# Altium project NetV510.PrjPCB
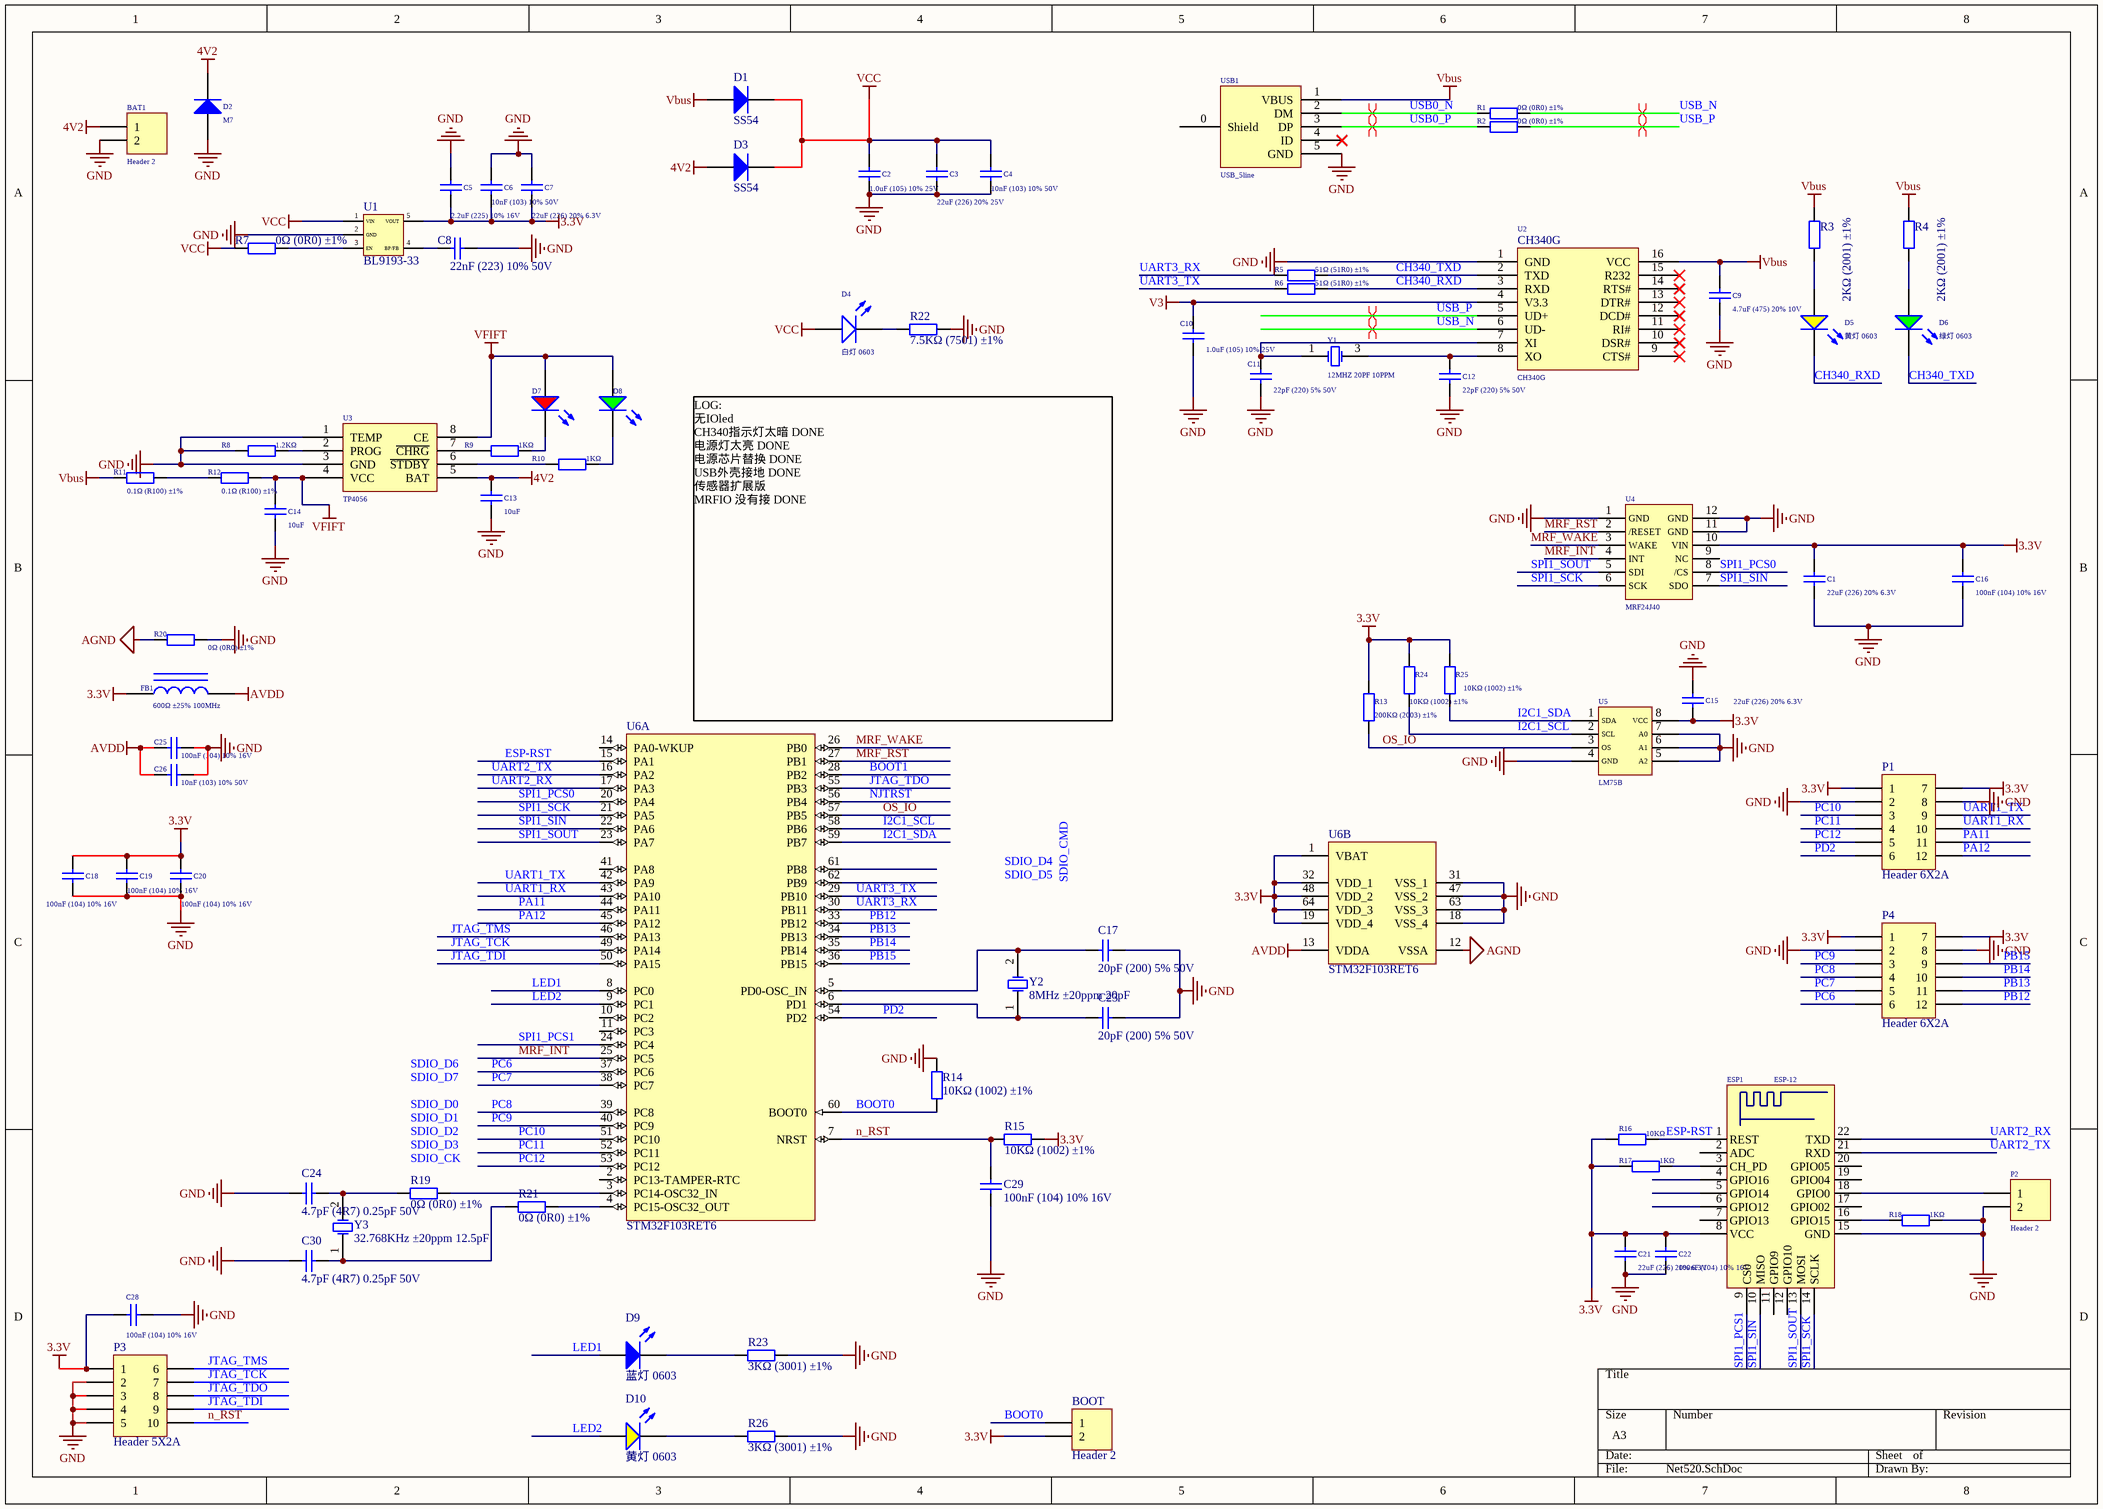
[diagram p0: Net520.SchDoc]
1 sheet, 83 parts. Net scope: global (net labels, ports and power ports of the same name join across sheets).
Board file: NetV520.PcbDoc

## Sheet Net520.SchDoc
size A3

### Parts
BAT1  Header 2  [HDR1X2]
BOOT  Header 2  [HDR1X2]
C1  22uF (226) 20% 6.3V  [0603_C]
C2  1.0uF (105) 10% 25V  [0402_C]
C3  22uF (226) 20% 25V  [0805_C]
C4  10nF (103) 10% 50V  [0402_C]
C5  2.2uF (225) 10% 16V  [0603_C]
C6  10nF (103) 10% 50V  [0402_C]
C7  22uF (226) 20% 6.3V  [0603_C]
C8  22nF (223) 10% 50V  [0402_C]
C9  4.7uF (475) 20% 10V  [0402_C]
C10  1.0uF (105) 10% 25V  [0402_C]
C11  22pF (220) 5% 50V  [0402_C]
C12  22pF (220) 5% 50V  [0402_C]
C13  10uF  [0402_C]
C14  10uF  [0402_C]
C15  22uF (226) 20% 6.3V  [0603_C]
C16  100nF (104) 10% 16V  [0402_C]
C17  20pF (200) 5% 50V  [0402_C]
C18  100nF (104) 10% 16V  [0402_C]
C19  100nF (104) 10% 16V  [0402_C]
C20  100nF (104) 10% 16V  [0402_C]
C21  22uF (226) 20% 6.3V  [0603_C]
C22  100nF (104) 10% 16V  [0402_C]
C23  20pF (200) 5% 50V  [0402_C]
C24  4.7pF (4R7) 0.25pF 50V  [0402_C]
C25  100nF (104) 10% 16V  [0402_C]
C26  10nF (103) 10% 50V  [0402_C]
C28  100nF (104) 10% 16V  [0402_C]
C29  100nF (104) 10% 16V  [0402_C]
C30  4.7pF (4R7) 0.25pF 50V  [0402_C]
D1  SS54  [SMA(DO-214AC)_S1]
D2  M7  [SMA(DO-214AC)_S1]
D3  SS54  [SMA(DO-214AC)_S1]
D4  白灯 0603  [0603_LED_S1]
D5  黄灯 0603  [0603_LED_S1]
D6  绿灯 0603  [0603_LED_S1]
D7  红灯 0603  [0603_LED_S1]  (value not drawn)
D8  绿灯 0603  [0603_LED_S1]  (value not drawn)
D9  蓝灯 0603  [0603_LED_S1]
D10  黄灯 0603  [0603_LED_S1]
ESP1  ESP-12  [ESP-12]
FB1  600Ω ±25% 100MHz  [0805_L]
P1  Header 6X2A  [SMT-HEADER 6*2]
P2  Header 2  [HDR1X2]
P3  Header 5X2A  [SMT HEADER 5*2]
P4  Header 6X2A  [SMT-HEADER 6*2]
R1  0Ω (0R0) ±1%  [0402_R]
R2  0Ω (0R0) ±1%  [0402_R]
R3  2KΩ (2001) ±1%  [0402_R]
R4  2KΩ (2001) ±1%  [0402_R]
R5  51Ω (51R0) ±1%  [0402_R]
R6  51Ω (51R0) ±1%  [0402_R]
R7  0Ω (0R0) ±1%  [0402_R]
R8  1.2KΩ  [0402_R]
R9  1KΩ  [0402_R]
R10  1KΩ  [0402_R]
R11  0.1Ω (R100) ±1%  [1206_R]
R12  0.1Ω (R100) ±1%  [1206_R]
R13  200KΩ (2003) ±1%  [0402_R]
R14  10KΩ (1002) ±1%  [0402_R]
R15  10KΩ (1002) ±1%  [0402_R]
R16  10KΩ  [0603_R]
R17  1KΩ  [0603_R]
R18  1KΩ  [0603_R]
R19  0Ω (0R0) ±1%  [0402_R]
R20  0Ω (0R0) ±1%  [0402_R]
R21  0Ω (0R0) ±1%  [0402_R]
R22  7.5KΩ (7501) ±1%  [0402_R]
R23  3KΩ (3001) ±1%  [0603_R]
R24  10KΩ (1002) ±1%  [0402_R]
R25  10KΩ (1002) ±1%  [0402_R]
R26  3KΩ (3001) ±1%  [0603_R]
U1  BL9193-33  [LC-SOT-23-5]
U2  CH340G  [SOIC-16_150mil]
U3  TP4056  [SOP-8_EP_150mil]
U4  MRF24J40  [MRF24J40]
U5  LM75B  [LC-SOIC-8_150mil]
U6  STM32F103RET6  [LQFP-64_10x10x05P]  (parts A,B of 2)
USB1  USB_5line  [USB-MICRO-5P-2F]
Y1  12MHZ 20PF 10PPM  [SMD-3225_4P]
Y2  8MHz ±20ppm 20pF  [SMD-5032_2P]
Y3  32.768KHz ±20ppm 12.5pF  [SMD-3215_2P FC - 135]

### Nets
3.3V: BOOT.2 C1.2 C5.1 C6.1 C7.1 C15.1 C16.2 C18.2 C19.2 C20.2 C21.2 C22.2 C28.1 ESP1.8(VCC) FB1.1 P1.1 P1.7 P3.1 P4.1 P4.7 R13.2 R15.1 R16.1 R17.1 R24.2 R25.2 U1.5(VOUT) U4.10(VIN) U5.8(VCC) U6.1(VBAT) U6.19(VDD_4) U6.32(VDD_1) U6.48(VDD_2) U6.64(VDD_3)
4V2: BAT1.1 C13.2 D2.2(K) D3.1(A) U3.5(BAT)
AGND: R20.1 U6.12(VSSA)
AVDD: C25.1 C26.1 FB1.2 U6.13(VDDA)
GND: BAT1.2 C1.1 C2.1 C3.1 C4.1 C5.2 C6.2 C7.2 C8.2 C9.1 C10.1 C11.1 C12.1 C13.1 C14.1 C15.2 C16.1 C17.1 C18.1 C19.1 C20.1 C21.1 C22.1 C23.1 C24.1 C25.2 C26.2 C28.2 C29.1 C30.1 D2.1(A) ESP1.15(GND) P1.2 P1.8 P2.2 P3.2 P3.3 P3.4 P3.5 P4.2 P4.8 R8.1 R14.2 R18.2 R20.2 R22.2 R23.2 R26.2 U1.2(GND) U2.1(GND) U3.1(TEMP) U3.3(GND) U4.1(GND) U4.11(GND) U4.12(GND) U5.4(GND) U5.5(A2) U5.6(A1) U5.7(A0) U6.18(VSS_4) U6.31(VSS_1) U6.47(VSS_2) U6.63(VSS_3) USB1.5(GND)
V3: C10.2 U2.4(V3.3)
Vbus: C9.2 D1.1(A) R3.2 R4.1 R11.1 U2.16(VCC) USB1.1(VBUS)
VCC: C2.2 C3.2 C4.2 D1.2(K) D3.2(K) D4.A R7.1 U1.1(VIN)
VFIFT: C14.2 D7.A D8.A R12.2 U3.4(VCC) U3.8(CE)
BOOT0: BOOT.1 R14.1 U6.60(BOOT0)
BOOT1: U6.28(PB2)
CH340_RXD: D5.K R6.2 U2.3(RXD)
CH340_TXD: D6.K R5.2 U2.2(TXD)
ESP-RST: ESP1.1(REST) R16.2 U6.15(PA1)
I2C1_SCL: R24.1 U5.2(SCL) U6.58(PB6)
I2C1_SDA: R25.1 U5.1(SDA) U6.59(PB7)
JTAG_TCK: P3.7 U6.49(PA14)
JTAG_TDI: P3.9 U6.50(PA15)
JTAG_TDO: P3.8 U6.55(PB3)
JTAG_TMS: P3.6 U6.46(PA13)
LED1: D9.A U6.8(PC0)
LED2: D10.A U6.9(PC1)
MRF_INT: U4.4(INT) U6.25(PC5)
MRF_RST: U4.2(/RESET) U6.27(PB1)
MRF_WAKE: U4.3(WAKE) U6.26(PB0)
n_RST: C29.2 P3.10 R15.2 U6.7(NRST)
NJTRST: U6.56(PB4)
OS_IO: R13.1 U5.3(OS) U6.57(PB5)
PA11: P1.11 U6.44(PA11)
PA12: P1.12 U6.45(PA12)
PB12: P4.12 U6.33(PB12)
PB13: P4.11 U6.34(PB13)
PB14: P4.10 U6.35(PB14)
PB15: P4.9 U6.36(PB15)
PC6: P4.6 U6.37(PC6)
PC7: P4.5 U6.38(PC7)
PC8: P4.4 U6.39(PC8)
PC9: P4.3 U6.40(PC9)
PC10: P1.3 U6.51(PC10)
PC11: P1.4 U6.52(PC11)
PC12: P1.5 U6.53(PC12)
PD2: P1.6 U6.54(PD2)
SPI1_PCS0: U4.8(/CS) U6.20(PA4)
SPI1_PCS1: ESP1.9(CS0) U6.24(PC4)
SPI1_SCK: ESP1.14(SCLK) U4.6(SCK) U6.21(PA5)
SPI1_SIN: ESP1.10(MISO) U4.7(SDO) U6.22(PA6)
SPI1_SOUT: ESP1.13(MOSI) U4.5(SDI) U6.23(PA7)
UART1_RX: P1.10 U6.43(PA10)
UART1_TX: P1.9 U6.42(PA9)
UART2_RX: ESP1.22(TXD) U6.17(PA3)
UART2_TX: ESP1.21(RXD) U6.16(PA2)
UART3_RX: R5.1 U6.30(PB11)
UART3_TX: R6.1 U6.29(PB10)
USB0_N: R1.1 USB1.2(DM)
USB0_P: R2.1 USB1.3(DP)
USB_N: R1.2 U2.6(UD-)
USB_P: R2.2 U2.5(UD+)
NetC8_1: C8.1 U1.4(BP/FB)
NetC11_2: C11.2 U2.7(XI) Y1.1(OSC1)
NetC12_2: C12.2 U2.8(XO) Y1.3(OSC2)
NetC17_2: C17.2 U6.5(PD0-OSC_IN) Y2.2(OSC2)
NetC23_2: C23.2 U6.6(PD1) Y2.1(OSC1)
NetC24_2: C24.2 R19.1 Y3.2(OSC2)
NetC30_2: C30.2 R21.1 Y3.1(OSC1)
NetD4_K: D4.K R22.1
NetD5_A: D5.A R3.1
NetD6_A: D6.A R4.2
NetD7_K: D7.K R9.2
NetD8_K: D8.K R10.2
NetD9_K: D9.K R23.1
NetD10_K: D10.K R26.1
NetESP1_3: ESP1.3(CH_PD) R17.2
NetESP1_16: ESP1.16(GPIO15) R18.1
NetESP1_18: ESP1.18(GPIO0) P2.1
NetR7_2: R7.2 U1.3(EN)
NetR8_2: R8.2 U3.2(PROG)
NetR9_1: R9.1 U3.7(~{CHRG})
NetR10_1: R10.1 U3.6(~{STDBY})
NetR11_2: R11.2 R12.1
NetR19_2: R19.2 U6.3(PC14-OSC32_IN)
NetR21_2: R21.2 U6.4(PC15-OSC32_OUT)

Not connected (* = marked no-connect by the designer): ESP1 2(ADC) 4(GPIO16) 5(GPIO14) 6(GPIO12) 7(GPIO13) 11(GPIO9) 12(GPIO10) 17(GPIO02) 19(GPIO04) 20(GPIO05); U2 9(CTS#)* 10(DSR#)* 11(RI#)* 12(DCD#)* 13(DTR#)* 14(RTS#)* 15(R232)*; U4 9(NC); U6 2(PC13-TAMPER-RTC) 10(PC2) 11(PC3) 14(PA0-WKUP) 41(PA8) 61(PB8) 62(PB9); USB1 0(Shield) 4(ID)*

### Layout directives
differential pair: USB0_N, USB0_P, USB_N, USB_P

### Notes on the sheet
- (near U6) LOG:
  无IOled
  CH340指示灯太暗 DONE
  电源灯太亮 DONE
  电源芯片替换 DONE
  USB外壳接地 DONE
  传感器扩展版
  MRFIO 没有接 DONE
- Labels drawn without touching a wire or pin: SDIO_CK, SDIO_CMD, SDIO_D0, SDIO_D1, SDIO_D2, SDIO_D3, SDIO_D4, SDIO_D5, SDIO_D6, SDIO_D7

### Library data of the parts
BAT1 BOOT P2 = Header 2: Header, 2-Pin; LatestRevisionDate: 17-Jul-2002; LatestRevisionNote: Re-released for DXP Platform.; Publisher: Altium Limited
C1 C7 C15 C21 = 0603 22uF (226) 20% 6.3V: 贴片电容; ComponentLink1Description: 供应商链接; ComponentLink1URL: http://www.szlcsc.com/product/details_60514.html; Package: 0603; Supplier: LC; SuppliersPartNumber: C59461
C2 C10 = 0402 1.0uF (105) 10% 25V: 贴片电容; ComponentLink1Description: 供应商链接; ComponentLink1URL: http://www.szlcsc.com/product/details_53938.html; Package: 0402; Supplier: LC; SuppliersPartNumber: C52923
C3 = 0805 22uF (226) 20% 25V: 贴片电容; ComponentLink1Description: 供应商链接; ComponentLink1URL: http://www.szlcsc.com/product/details_46786.html; Package: 0805; Supplier: LC; SuppliersPartNumber: C45783
C4 C6 C26 = 0402 10nF (103) 10% 50V: 贴片电容; ComponentLink1Description: 供应商链接; ComponentLink1URL: http://www.szlcsc.com/product/details_15869.html; Package: 0402; Supplier: LC; SuppliersPartNumber: C15195
C5 = 0603 2.2uF (225) 10% 16V: 贴片电容; ComponentLink1Description: 供应商链接; ComponentLink1URL: http://www.szlcsc.com/product/details_24366.html; Package: 0603; Supplier: LC; SuppliersPartNumber: C23630
C8 = 0402 22nF (223) 10% 50V: 贴片电容; ComponentLink1Description: 供应商链接; ComponentLink1URL: http://www.szlcsc.com/product/details_1884.html; Package: 0402; Supplier: LC; SuppliersPartNumber: C1532
C9 = 0402 4.7uF (475) 20% 10V: 贴片电容; ComponentLink1Description: 供应商链接; ComponentLink1URL: http://www.szlcsc.com/product/details_24469.html; Package: 0402; Supplier: LC; SuppliersPartNumber: C23733
C11 C12 = 0402 22pF (220) 5% 50V: 贴片电容; ComponentLink1Description: 供应商链接; ComponentLink1URL: http://www.szlcsc.com/product/details_1907.html; Package: 0402; Supplier: LC; SuppliersPartNumber: C1555
C13 C14 = 0402 10uF (106) 20% 6.3V: 贴片电容; ComponentLink1Description: 供应商链接; ComponentLink1URL: http://www.szlcsc.com/product/details_16204.html; Package: 0402; Supplier: LC; SuppliersPartNumber: C15525
C16 C18-C20 C22 C25 C28 C29 = 0402 100nF (104) 10% 16V: 贴片电容; ComponentLink1Description: 供应商链接; ComponentLink1URL: http://www.szlcsc.com/product/details_1877.html; Package: 0402; Supplier: LC; SuppliersPartNumber: C1525
C17 C23 = 0402 20pF (200) 5% 50V: 贴片电容; ComponentLink1Description: 供应商链接; ComponentLink1URL: http://www.szlcsc.com/product/details_1906.html; Package: 0402; Supplier: LC; SuppliersPartNumber: C1554
C24 C30 = 0402 4.7pF (4R7) 0.25pF 50V: 贴片电容; ComponentLink1Description: 供应商链接; ComponentLink1URL: http://www.szlcsc.com/product/details_1921.html; Package: 0402; Supplier: LC; SuppliersPartNumber: C1569
D1 D3 = SMA(DO-214AC) SS54: 二极管; ComponentLink1Description: 供应商链接; ComponentLink1URL: http://www.szlcsc.com/product/details_23178.html; Package: SMA(DO-214AC); Supplier: LC; SuppliersPartNumber: C22452
D2 = SMA(DO-214AC) M7: 二极管; Notepad: 1N4007 4007 编号C2464 已经停售, 使用新物料编号C95872; ComponentLink1Description: 供应商链接; ComponentLink1URL: http://www.szlcsc.com/product/details_2841.html; Package: SMA(DO-214AC); Supplier: LC; SuppliersPartNumber: C95872
D4 = 0603 白灯: 发光二极管; ComponentLink1Description: 供应商链接; ComponentLink1URL: http://www.szlcsc.com/product/details_2663.html; Package: 0603; Supplier: LC; SuppliersPartNumber: C2290
D5 D10 = 0603 黄灯: 发光二极管; ComponentLink1Description: 供应商链接; ComponentLink1URL: http://www.szlcsc.com/product/details_73147.html; Package: 0603; Supplier: LC; SuppliersPartNumber: C72038
D6 D8 = 0603 绿灯: 发光二极管; ComponentLink1Description: 供应商链接; ComponentLink1URL: http://www.szlcsc.com/product/details_73152.html; Package: 0603; Supplier: LC; SuppliersPartNumber: C72043
D7 = 0603 红灯: 发光二极管; ComponentLink1Description: 供应商链接; ComponentLink1URL: http://www.szlcsc.com/product/details_2659.html; Package: 0603; Supplier: LC; SuppliersPartNumber: C2286
D9 = 0603 蓝灯: 发光二极管; ComponentLink1Description: 供应商链接; ComponentLink1URL: http://www.szlcsc.com/product/details_73150.html; Package: 0603; Supplier: LC; SuppliersPartNumber: C72041
FB1 = 0805 600Ω 25% 100MHz: 贴片磁珠; ComponentLink1Description: 供应商链接; ComponentLink1URL: http://www.szlcsc.com/product/details_1369.html; Package: 0805; Supplier: LC; SuppliersPartNumber: C1017
P1 P4 = Header 6X2A: Header, 6-Pin, Dual row; LatestRevisionDate: 17-Jul-2002; LatestRevisionNote: Re-released for DXP Platform.; Publisher: Altium Limited
P3 = Header 5X2A: Header, 5-Pin, Dual row; LatestRevisionDate: 17-Jul-2002; LatestRevisionNote: Re-released for DXP Platform.; Publisher: Altium Limited
R1 R2 R7 R19-R21 = 0402 0Ω (0R0) 1%: 贴片电阻; ComponentLink1Description: 供应商链接; ComponentLink1URL: http://www.szlcsc.com/product/details_17853.html; Package: 0402; Supplier: LC; SuppliersPartNumber: C17168
R3 R4 = 0402 2KΩ (2001) 1%: 贴片电阻; ComponentLink1Description: 供应商链接; ComponentLink1URL: http://www.szlcsc.com/product/details_4516.html; Package: 0402; Supplier: LC; SuppliersPartNumber: C4109
R5 R6 = 0402 51Ω (51R0) 1%: 贴片电阻; ComponentLink1Description: 供应商链接; ComponentLink1URL: http://www.szlcsc.com/product/details_25868.html; Package: 0402; Supplier: LC; SuppliersPartNumber: C25125
R8 = 0402 1.2KΩ (1201) 1%: 贴片电阻; ComponentLink1Description: 供应商链接; ComponentLink1URL: http://www.szlcsc.com/product/details_26605.html; Package: 0402; Supplier: LC; SuppliersPartNumber: C25862
R9 R10 = 0402 1KΩ (1001) 1%: 贴片电阻; ComponentLink1Description: 供应商链接; ComponentLink1URL: http://www.szlcsc.com/product/details_12256.html; Package: 0402; Supplier: LC; SuppliersPartNumber: C11702
R11 R12 = 1206 0.1Ω (R100) 1%: 贴片电阻; ComponentLink1Description: 供应商链接; ComponentLink1URL: http://www.szlcsc.com/product/details_26077.html; Package: 1206; Supplier: LC; SuppliersPartNumber: C25334
R13 = 0402 200KΩ (2003) 1%: 贴片电阻; ComponentLink1Description: 供应商链接; ComponentLink1URL: http://www.szlcsc.com/product/details_26507.html; Package: 0402; Supplier: LC; SuppliersPartNumber: C25764
R14 R15 R24 R25 = 0402 10KΩ (1002) 1%: 贴片电阻; ComponentLink1Description: 供应商链接; ComponentLink1URL: http://www.szlcsc.com/product/details_26487.html; Package: 0402; Supplier: LC; SuppliersPartNumber: C25744
R16 = 0603 10KΩ (1002) 1%: 贴片电阻; ComponentLink1Description: 供应商链接; ComponentLink1URL: http://www.szlcsc.com/product/details_26547.html; Package: 0603; Supplier: LC; SuppliersPartNumber: C25804
R17 R18 = 0603 1KΩ (1001) 1%: 贴片电阻; ComponentLink1Description: 供应商链接; ComponentLink1URL: http://www.szlcsc.com/product/details_21904.html; Package: 0603; Supplier: LC; SuppliersPartNumber: C21190
R22 = 0402 7.5KΩ (7501) 1%: 贴片电阻; ComponentLink1Description: 供应商链接; ComponentLink1URL: http://www.szlcsc.com/product/details_26661.html; Package: 0402; Supplier: LC; SuppliersPartNumber: C25918
R23 R26 = 0603 3KΩ (3001) 1%: 贴片电阻; ComponentLink1Description: 供应商链接; ComponentLink1URL: http://www.szlcsc.com/product/details_4618.html; Package: 0603; Supplier: LC; SuppliersPartNumber: C4211
U2 = CH340G_[C14267]: USB; ComponentLink1Description: 供应商链接; ComponentLink1URL: http://www.szlcsc.com/product/details_14927.html; Package: SOIC-16_150mil; Supplier: LC; SuppliersPartNumber: C14267
U3 = TP4056_[C16581]: 电池电源管理; ComponentLink1Description: 供应商链接; ComponentLink1URL: http://www.szlcsc.com/product/details_17264.html; Package: SOP-8_EP_150mil; Supplier: LC; SuppliersPartNumber: C16581
U6 = STM32F103RET6: ARM; ComponentLink1Description: 供应商链接; ComponentLink1URL: http://www.szlcsc.com/product/details_8814.html; Package: LQFP-64_10x10x05P; Supplier: LC; SuppliersPartNumber: C8322
Y1 = SMD-3225_4P  12MHZ 20PF 10PPM: 贴片晶振; ComponentLink1Description: 供应商链接; ComponentLink1URL: http://www.szlcsc.com/product/details_9522.html; Package: SMD-3225_4P; Supplier: LC; SuppliersPartNumber: C9002
Y2 = SMD-5032_2P 8MHz 20ppm 20pF: 贴片晶振; ComponentLink1Description: 供应商链接; ComponentLink1URL: http://www.szlcsc.com/product/details_117214.html; Package: SMD-5032_2P; Supplier: LC; SuppliersPartNumber: C115962
Y3 = SMD-3215_2P 32.768KHz 20ppm 12.5pF: 贴片晶振; ComponentLink1Description: 供应商链接; ComponentLink1URL: http://www.szlcsc.com/product/details_33310.html; Package: SMD-3215_2P; Supplier: LC; SuppliersPartNumber: C32346